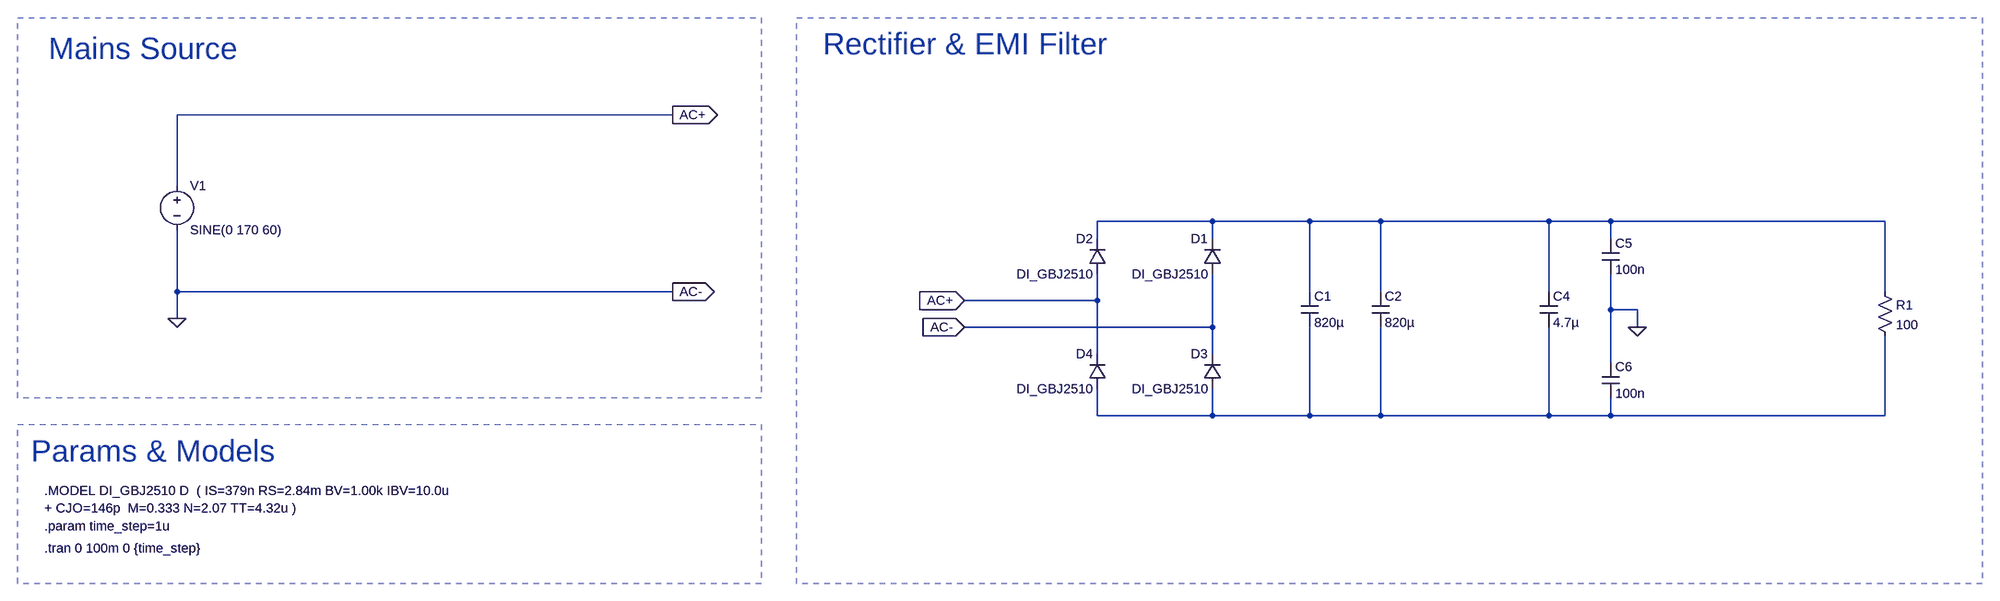
[diagram p0: schematic Rectifier.asc]
Rectifier.asc, the LTspice schematic file:
Version 4.1
SHEET 1 3640 680
WIRE 512 -912 -384 -912
WIRE -384 -784 -384 -912
WIRE 1488 -720 1280 -720
WIRE 1664 -720 1488 -720
WIRE 1792 -720 1664 -720
WIRE 2096 -720 1792 -720
WIRE 2208 -720 2096 -720
WIRE 2704 -720 2208 -720
WIRE 1280 -688 1280 -720
WIRE 1488 -688 1488 -720
WIRE 2208 -688 2208 -720
WIRE -384 -592 -384 -704
WIRE 512 -592 -384 -592
WIRE 1664 -592 1664 -720
WIRE 1792 -592 1792 -720
WIRE 2096 -592 2096 -720
WIRE 2704 -592 2704 -720
WIRE 1280 -576 1280 -624
WIRE 1280 -576 1040 -576
WIRE 2208 -560 2208 -624
WIRE 2256 -560 2208 -560
WIRE -384 -544 -384 -592
WIRE 1488 -528 1488 -624
WIRE 1488 -528 1040 -528
WIRE 2256 -528 2256 -560
WIRE 1280 -480 1280 -576
WIRE 1488 -480 1488 -528
WIRE 2208 -464 2208 -560
WIRE 1280 -368 1280 -416
WIRE 1488 -368 1488 -416
WIRE 1488 -368 1280 -368
WIRE 1664 -368 1664 -528
WIRE 1664 -368 1488 -368
WIRE 1792 -368 1792 -528
WIRE 1792 -368 1664 -368
WIRE 2096 -368 2096 -528
WIRE 2096 -368 1792 -368
WIRE 2208 -368 2208 -400
WIRE 2208 -368 2096 -368
WIRE 2704 -368 2704 -512
WIRE 2704 -368 2208 -368
FLAG 1040 -576 AC+
IOPIN 1040 -576 In
FLAG 1040 -528 AC-
IOPIN 1040 -528 In
FLAG 512 -912 AC+
IOPIN 512 -912 Out
FLAG 512 -592 AC-
IOPIN 512 -592 Out
FLAG -384 -544 0
FLAG 2256 -528 0
SYMBOL voltage -384 -800 R0
WINDOW 123 0 0 Left 0
WINDOW 39 0 0 Left 0
SYMATTR InstName V1
SYMATTR Value SINE(0 170 60)
SYMBOL cap 1648 -592 R0
SYMATTR InstName C1
SYMATTR Value 820µ
SYMBOL cap 1776 -592 R0
SYMATTR InstName C2
SYMATTR Value 820µ
SYMBOL cap 2080 -592 R0
SYMATTR InstName C4
SYMATTR Value 4.7µ
SYMBOL cap 2192 -688 R0
SYMATTR InstName C5
SYMATTR Value 100n
SYMBOL cap 2192 -464 R0
SYMATTR InstName C6
SYMATTR Value 100n
SYMBOL diode 1504 -624 R180
WINDOW 0 24 64 Left 2
WINDOW 3 24 0 Left 2
SYMATTR InstName D1
SYMATTR Value DI_GBJ2510
SYMBOL diode 1296 -624 R180
WINDOW 0 24 64 Left 2
WINDOW 3 24 0 Left 2
SYMATTR InstName D2
SYMATTR Value DI_GBJ2510
SYMBOL diode 1504 -416 R180
WINDOW 0 24 64 Left 2
WINDOW 3 24 0 Left 2
SYMATTR InstName D3
SYMATTR Value DI_GBJ2510
SYMBOL diode 1296 -416 R180
WINDOW 0 24 64 Left 2
WINDOW 3 24 0 Left 2
SYMATTR InstName D4
SYMATTR Value DI_GBJ2510
SYMBOL res 2688 -608 R0
SYMATTR InstName R1
SYMATTR Value 100
TEXT -624 -232 Left 2 !.MODEL DI_GBJ2510 D  ( IS=379n RS=2.84m BV=1.00k IBV=10.0u\n+ CJO=146p  M=0.333 N=2.07 TT=4.32u )
TEXT 784 -1040 Left 5 ;Rectifier & EMI Filter
TEXT -616 -1032 Left 5 ;Mains Source
TEXT -624 -128 Left 2 !.tran 0 100m 0 {time_step}
TEXT -624 -168 Left 2 !.param time_step=1u
TEXT -648 -304 Left 5 ;Params & Models
RECTANGLE Normal 672 -400 -672 -1088 1
RECTANGLE Normal 672 -64 -672 -352 1
RECTANGLE Normal 2880 -64 736 -1088 1

The netlist it stands for:
* Rectifier.asc
V1 AC+ 0 SINE(0 170 60)
C1 N001 N002 820µ
C2 N001 N002 820µ
C4 N001 N002 4.7µ
C5 N001 0 100n
C6 0 N002 100n
D1 0 N001 DI_GBJ2510
D2 AC+ N001 DI_GBJ2510
D3 N002 0 DI_GBJ2510
D4 N002 AC+ DI_GBJ2510
R1 N001 N002 100
.model D D
.lib standard.dio
.MODEL DI_GBJ2510 D  ( IS=379n RS=2.84m BV=1.00k IBV=10.0u
+ CJO=146p  M=0.333 N=2.07 TT=4.32u )
* Rectifier & EMI Filter
* Mains Source
.tran 0 100m 0 {time_step}
.param time_step=1u
* Params & Models
.backanno
.end